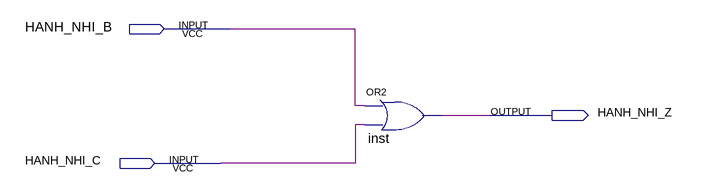
[diagram p0: schematic sheet]
// Quartus schematic Assignment2b.bdf as structural Verilog: 1 symbols, 3 pins
module Assignment2b (
  input  HANH_NHI_B,
  input  HANH_NHI_C,
  output HANH_NHI_Z
);

  or inst (HANH_NHI_Z, HANH_NHI_B, HANH_NHI_C);
endmodule
